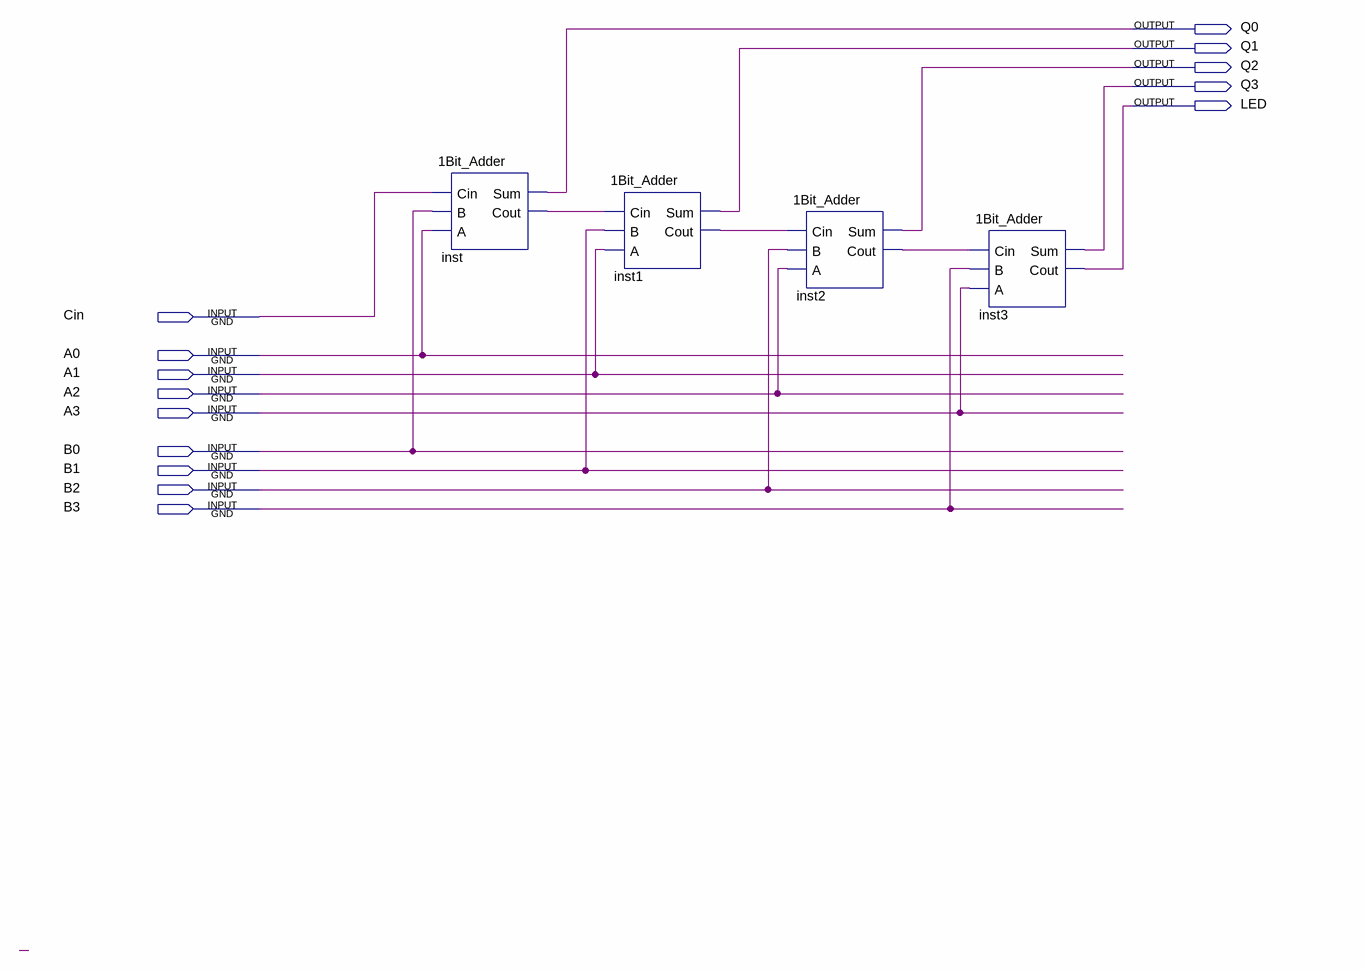
[diagram p0: schematic sheet]
// Quartus schematic 4Bit_Adder.bdf as structural Verilog: 4 symbols, 14 pins
module \4Bit_Adder  (
  input  Cin,
  input  A0,
  input  A1,
  input  A2,
  input  A3,
  input  B0,
  input  B1,
  input  B2,
  input  B3,
  output Q0,
  output Q1,
  output Q2,
  output Q3,
  output LED
);

  wire inst1_cout, inst2_cout, inst_cout;

  \1Bit_Adder  inst (.Cin(Cin), .B(B0), .A(A0), .Sum(Q0), .Cout(inst_cout));
  \1Bit_Adder  inst1 (.Cin(inst_cout), .B(B1), .A(A1), .Sum(Q1), .Cout(inst1_cout));
  \1Bit_Adder  inst2 (.Cin(inst1_cout), .B(B2), .A(A2), .Sum(Q2), .Cout(inst2_cout));
  \1Bit_Adder  inst3 (.Cin(inst2_cout), .B(B3), .A(A3), .Sum(Q3), .Cout(LED));
endmodule
